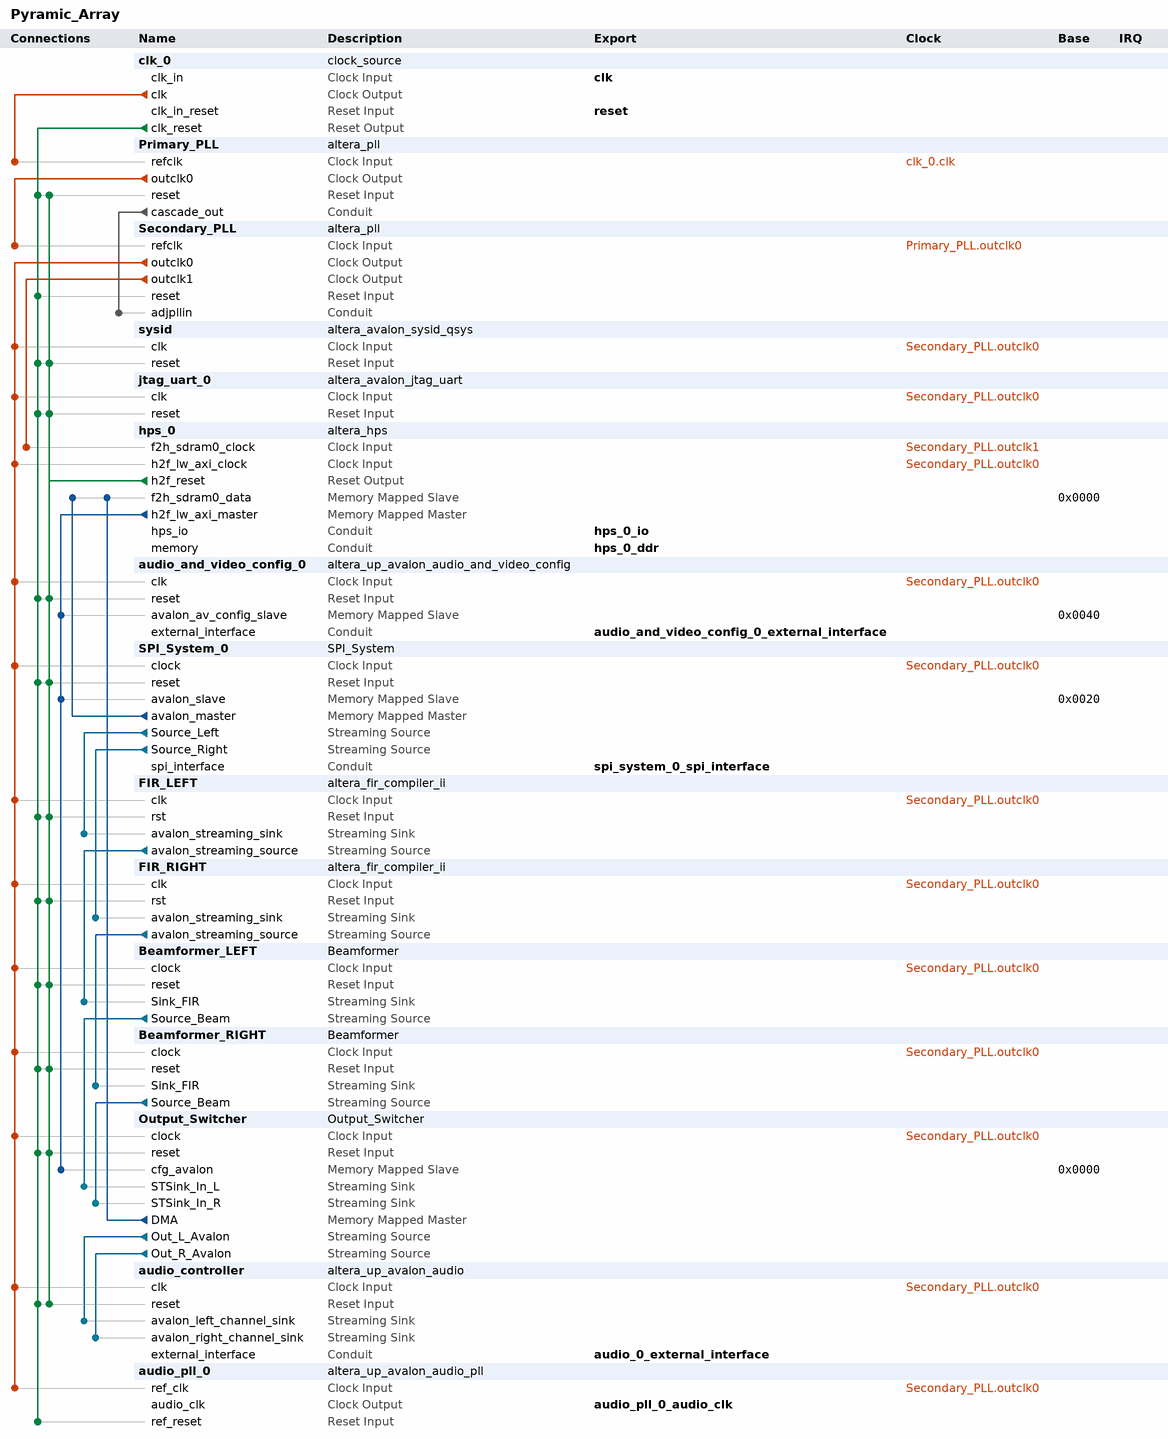
[diagram p0: system contents]
# Platform Designer (Qsys) system Pyramic_Array, Cyclone V 5CSEMA5F31C6
# Parameters at their usual value, and those the tool derives, are not listed.
package require -exact qsys 16.0
create_system Pyramic_Array
set_project_property DEVICE_FAMILY {Cyclone V}
set_project_property DEVICE 5CSEMA5F31C6

add_instance clk_0 clock_source 16.0
set_instance_parameter_value clk_0 clockFrequency 50000000

add_instance Primary_PLL altera_pll 16.0
set_instance_parameter_value Primary_PLL gui_device_speed_grade 2
set_instance_parameter_value Primary_PLL gui_enable_cascade_out true
set_instance_parameter_value Primary_PLL gui_number_of_clocks 1
set_instance_parameter_value Primary_PLL gui_operation_mode normal
set_instance_parameter_value Primary_PLL gui_output_clock_frequency0 48.0
set_instance_parameter_value Primary_PLL gui_pll_mode {Integer-N PLL}
set_instance_parameter_value Primary_PLL gui_reference_clock_frequency 50.0
set_instance_parameter_value Primary_PLL gui_use_locked false

add_instance Secondary_PLL altera_pll 16.0
set_instance_parameter_value Secondary_PLL gui_device_speed_grade 1
set_instance_parameter_value Secondary_PLL gui_enable_cascade_in true
set_instance_parameter_value Secondary_PLL gui_number_of_clocks 2
set_instance_parameter_value Secondary_PLL gui_operation_mode direct
set_instance_parameter_value Secondary_PLL gui_output_clock_frequency0 48.0
set_instance_parameter_value Secondary_PLL gui_output_clock_frequency1 96.0
set_instance_parameter_value Secondary_PLL gui_pll_mode {Integer-N PLL}
set_instance_parameter_value Secondary_PLL gui_reference_clock_frequency 48.0
set_instance_parameter_value Secondary_PLL gui_use_locked false

add_instance sysid altera_avalon_sysid_qsys 16.0
set_instance_parameter_value sysid id 1

add_instance jtag_uart_0 altera_avalon_jtag_uart 16.0
set_instance_parameter_value jtag_uart_0 simInteractiveOptions NO_INTERACTIVE_WINDOWS

add_instance hps_0 altera_hps 16.0
set_instance_parameter_value hps_0 EMAC1_Mode RGMII
set_instance_parameter_value hps_0 EMAC1_PinMuxing {HPS I/O Set 0}
set_instance_parameter_value hps_0 F2SCLK_COLDRST_Enable false
set_instance_parameter_value hps_0 F2SCLK_DBGRST_Enable false
set_instance_parameter_value hps_0 F2SCLK_WARMRST_Enable false
set_instance_parameter_value hps_0 F2SDRAM_Type {Avalon-MM Bidirectional}
set_instance_parameter_value hps_0 F2SDRAM_Width 32
set_instance_parameter_value hps_0 F2SINTERRUPT_Enable false
set_instance_parameter_value hps_0 F2S_Width 0
set_instance_parameter_value hps_0 FPGA_PERIPHERAL_OUTPUT_CLOCK_FREQ_EMAC0_GTX_CLK 125
set_instance_parameter_value hps_0 FPGA_PERIPHERAL_OUTPUT_CLOCK_FREQ_EMAC0_MD_CLK 2.5
set_instance_parameter_value hps_0 FPGA_PERIPHERAL_OUTPUT_CLOCK_FREQ_EMAC1_GTX_CLK 125
set_instance_parameter_value hps_0 FPGA_PERIPHERAL_OUTPUT_CLOCK_FREQ_EMAC1_MD_CLK 2.5
set_instance_parameter_value hps_0 HPS_PROTOCOL DDR3
set_instance_parameter_value hps_0 I2C0_Mode N/A
set_instance_parameter_value hps_0 I2C0_PinMuxing Unused
set_instance_parameter_value hps_0 I2C1_Mode N/A
set_instance_parameter_value hps_0 I2C1_PinMuxing Unused
set_instance_parameter_value hps_0 LWH2F_Enable true
set_instance_parameter_value hps_0 MEM_BANKADDR_WIDTH 3
set_instance_parameter_value hps_0 MEM_CLK_FREQ 400.0
set_instance_parameter_value hps_0 MEM_COL_ADDR_WIDTH 10
set_instance_parameter_value hps_0 MEM_DQ_WIDTH 32
set_instance_parameter_value hps_0 MEM_DRV_STR RZQ/7
set_instance_parameter_value hps_0 MEM_ROW_ADDR_WIDTH 15
set_instance_parameter_value hps_0 MEM_RTT_NOM RZQ/4
set_instance_parameter_value hps_0 MEM_RTT_WR RZQ/4
set_instance_parameter_value hps_0 MEM_TCL 11
set_instance_parameter_value hps_0 MEM_TFAW_NS 30.0
set_instance_parameter_value hps_0 MEM_TRAS_NS 35.0
set_instance_parameter_value hps_0 MEM_TRCD_NS 13.75
set_instance_parameter_value hps_0 MEM_TRFC_NS 260.0
set_instance_parameter_value hps_0 MEM_TRP_NS 13.75
set_instance_parameter_value hps_0 MEM_VENDOR Other
set_instance_parameter_value hps_0 MEM_WTCL 8
set_instance_parameter_value hps_0 QSPI_Mode N/A
set_instance_parameter_value hps_0 QSPI_PinMuxing Unused
set_instance_parameter_value hps_0 REF_CLK_FREQ 25.0
set_instance_parameter_value hps_0 S2FCLK_USER2CLK 1
set_instance_parameter_value hps_0 S2F_Width 0
set_instance_parameter_value hps_0 SDIO_Mode {4-bit Data}
set_instance_parameter_value hps_0 SDIO_PinMuxing {HPS I/O Set 0}
set_instance_parameter_value hps_0 SPIM1_Mode N/A
set_instance_parameter_value hps_0 SPIM1_PinMuxing Unused
set_instance_parameter_value hps_0 STM_Enable false
set_instance_parameter_value hps_0 TIMING_BOARD_AC_SKEW 0.02
set_instance_parameter_value hps_0 TIMING_BOARD_AC_TO_CK_SKEW 0.01
set_instance_parameter_value hps_0 TIMING_BOARD_DQ_TO_DQS_SKEW 0.05
set_instance_parameter_value hps_0 TIMING_BOARD_MAX_CK_DELAY 0.03
set_instance_parameter_value hps_0 TIMING_BOARD_MAX_DQS_DELAY 0.02
set_instance_parameter_value hps_0 TIMING_BOARD_SKEW_BETWEEN_DQS 0.06
set_instance_parameter_value hps_0 TIMING_BOARD_SKEW_CKDQS_DIMM_MAX 0.12
set_instance_parameter_value hps_0 TIMING_BOARD_SKEW_CKDQS_DIMM_MIN 0.06
set_instance_parameter_value hps_0 TIMING_BOARD_SKEW_WITHIN_DQS 0.01
set_instance_parameter_value hps_0 TIMING_TDH 65
set_instance_parameter_value hps_0 TIMING_TDQSCK 255
set_instance_parameter_value hps_0 TIMING_TDQSQ 125
set_instance_parameter_value hps_0 TIMING_TDS 30
set_instance_parameter_value hps_0 TIMING_TIH 140
set_instance_parameter_value hps_0 TIMING_TIS 180
set_instance_parameter_value hps_0 TIMING_TQSH 0.4
set_instance_parameter_value hps_0 UART0_Mode {No Flow Control}
set_instance_parameter_value hps_0 UART0_PinMuxing {HPS I/O Set 0}
set_instance_parameter_value hps_0 USB1_Mode N/A
set_instance_parameter_value hps_0 USB1_PinMuxing Unused
set_instance_parameter_value hps_0 desired_cfg_clk_mhz 100.0
set_instance_parameter_value hps_0 desired_qspi_clk_mhz 400.0

add_instance audio_and_video_config_0 altera_up_avalon_audio_and_video_config 15.1
set_instance_parameter_value audio_and_video_config_0 audio_in {Microphone to ADC}
set_instance_parameter_value audio_and_video_config_0 bit_length 16
set_instance_parameter_value audio_and_video_config_0 board DE1-SoC
set_instance_parameter_value audio_and_video_config_0 line_in_bypass false
set_instance_parameter_value audio_and_video_config_0 sampling_rate {48 kHz}

add_instance SPI_System_0 SPI_System 1.0

add_instance FIR_LEFT altera_fir_compiler_ii 16.0
set_instance_parameter_value FIR_LEFT coeffBitWidth 15
set_instance_parameter_value FIR_LEFT coeffFracBitWidth 15
set_instance_parameter_value FIR_LEFT coeffReload false
set_instance_parameter_value FIR_LEFT coeffType frac
set_instance_parameter_value FIR_LEFT decimFactor 3
set_instance_parameter_value FIR_LEFT filterType frac
set_instance_parameter_value FIR_LEFT inputBitWidth 16
set_instance_parameter_value FIR_LEFT inputChannelNum 48
set_instance_parameter_value FIR_LEFT inputFracBitWidth 0
set_instance_parameter_value FIR_LEFT inputRate 0.048
set_instance_parameter_value FIR_LEFT inputType int
set_instance_parameter_value FIR_LEFT interpFactor 2
set_instance_parameter_value FIR_LEFT outLsbBitRem 7
set_instance_parameter_value FIR_LEFT outMsbBitRem 0
set_instance_parameter_value FIR_LEFT outType int
set_instance_parameter_value FIR_LEFT readWriteMode read_write
set_instance_parameter_value FIR_LEFT speedGrade medium

add_instance FIR_RIGHT altera_fir_compiler_ii 16.0
set_instance_parameter_value FIR_RIGHT coeffBitWidth 15
set_instance_parameter_value FIR_RIGHT coeffFracBitWidth 15
set_instance_parameter_value FIR_RIGHT coeffReload false
set_instance_parameter_value FIR_RIGHT coeffType frac
set_instance_parameter_value FIR_RIGHT decimFactor 3
set_instance_parameter_value FIR_RIGHT filterType frac
set_instance_parameter_value FIR_RIGHT inputBitWidth 16
set_instance_parameter_value FIR_RIGHT inputChannelNum 48
set_instance_parameter_value FIR_RIGHT inputFracBitWidth 0
set_instance_parameter_value FIR_RIGHT inputRate 0.048
set_instance_parameter_value FIR_RIGHT inputType int
set_instance_parameter_value FIR_RIGHT interpFactor 2
set_instance_parameter_value FIR_RIGHT outLsbBitRem 7
set_instance_parameter_value FIR_RIGHT outMsbBitRem 0
set_instance_parameter_value FIR_RIGHT outType int
set_instance_parameter_value FIR_RIGHT readWriteMode read_write
set_instance_parameter_value FIR_RIGHT speedGrade medium

add_instance Beamformer_LEFT Beamformer 1.0
set_instance_parameter_value Beamformer_LEFT DATA_WIDTH 32

add_instance Beamformer_RIGHT Beamformer 1.0
set_instance_parameter_value Beamformer_RIGHT DATA_WIDTH 32

add_instance Output_Switcher Output_Switcher 1.0
set_instance_parameter_value Output_Switcher ONE_CHANNEL_SAMPLE_WIDTH 16
set_instance_parameter_value Output_Switcher TWO_CHANNELS_SAMPLE_WIDTH 32

add_instance audio_controller altera_up_avalon_audio 15.1
set_instance_parameter_value audio_controller audio_in false
set_instance_parameter_value audio_controller avalon_bus_type Streaming
set_instance_parameter_value audio_controller dw 16

add_instance audio_pll_0 altera_up_avalon_audio_pll 15.1
set_instance_parameter_value audio_pll_0 gui_refclk 48.0

# connections
add_connection clk_0.clk Primary_PLL.refclk clock
add_connection Primary_PLL.outclk0 Secondary_PLL.refclk clock
add_connection Secondary_PLL.outclk0 audio_and_video_config_0.clk clock
add_connection Secondary_PLL.outclk0 audio_controller.clk clock
add_connection Secondary_PLL.outclk0 audio_pll_0.ref_clk clock
add_connection Secondary_PLL.outclk0 Beamformer_LEFT.clock clock
add_connection Secondary_PLL.outclk0 Beamformer_RIGHT.clock clock
add_connection Secondary_PLL.outclk0 FIR_LEFT.clk clock
add_connection Secondary_PLL.outclk0 FIR_RIGHT.clk clock
add_connection Secondary_PLL.outclk0 hps_0.h2f_lw_axi_clock clock
add_connection Secondary_PLL.outclk0 jtag_uart_0.clk clock
add_connection Secondary_PLL.outclk0 Output_Switcher.clock clock
add_connection Secondary_PLL.outclk0 SPI_System_0.clock clock
add_connection Secondary_PLL.outclk0 sysid.clk clock
add_connection Secondary_PLL.outclk1 hps_0.f2h_sdram0_clock clock
add_connection clk_0.clk_reset audio_and_video_config_0.reset reset
add_connection clk_0.clk_reset audio_controller.reset reset
add_connection clk_0.clk_reset audio_pll_0.ref_reset reset
add_connection clk_0.clk_reset Beamformer_LEFT.reset reset
add_connection clk_0.clk_reset Beamformer_RIGHT.reset reset
add_connection clk_0.clk_reset FIR_LEFT.rst reset
add_connection clk_0.clk_reset FIR_RIGHT.rst reset
add_connection clk_0.clk_reset jtag_uart_0.reset reset
add_connection clk_0.clk_reset Output_Switcher.reset reset
add_connection clk_0.clk_reset Primary_PLL.reset reset
add_connection clk_0.clk_reset Secondary_PLL.reset reset
add_connection clk_0.clk_reset SPI_System_0.reset reset
add_connection clk_0.clk_reset sysid.reset reset
add_connection hps_0.h2f_reset audio_and_video_config_0.reset reset
add_connection hps_0.h2f_reset audio_controller.reset reset
add_connection hps_0.h2f_reset Beamformer_LEFT.reset reset
add_connection hps_0.h2f_reset Beamformer_RIGHT.reset reset
add_connection hps_0.h2f_reset FIR_LEFT.rst reset
add_connection hps_0.h2f_reset FIR_RIGHT.rst reset
add_connection hps_0.h2f_reset jtag_uart_0.reset reset
add_connection hps_0.h2f_reset Output_Switcher.reset reset
add_connection hps_0.h2f_reset Primary_PLL.reset reset
add_connection hps_0.h2f_reset SPI_System_0.reset reset
add_connection hps_0.h2f_reset sysid.reset reset
add_connection hps_0.h2f_lw_axi_master audio_and_video_config_0.avalon_av_config_slave avalon
set_connection_parameter_value hps_0.h2f_lw_axi_master/audio_and_video_config_0.avalon_av_config_slave baseAddress 0x0040
add_connection hps_0.h2f_lw_axi_master Output_Switcher.cfg_avalon avalon
set_connection_parameter_value hps_0.h2f_lw_axi_master/Output_Switcher.cfg_avalon baseAddress 0x0000
add_connection hps_0.h2f_lw_axi_master SPI_System_0.avalon_slave avalon
set_connection_parameter_value hps_0.h2f_lw_axi_master/SPI_System_0.avalon_slave baseAddress 0x0020
add_connection Output_Switcher.DMA hps_0.f2h_sdram0_data avalon
set_connection_parameter_value Output_Switcher.DMA/hps_0.f2h_sdram0_data baseAddress 0x0000
add_connection SPI_System_0.avalon_master hps_0.f2h_sdram0_data avalon
set_connection_parameter_value SPI_System_0.avalon_master/hps_0.f2h_sdram0_data baseAddress 0x0000
add_connection Beamformer_LEFT.Source_Beam Output_Switcher.STSink_In_L avalon_streaming
add_connection Beamformer_RIGHT.Source_Beam Output_Switcher.STSink_In_R avalon_streaming
add_connection FIR_LEFT.avalon_streaming_source Beamformer_LEFT.Sink_FIR avalon_streaming
add_connection FIR_RIGHT.avalon_streaming_source Beamformer_RIGHT.Sink_FIR avalon_streaming
add_connection Output_Switcher.Out_L_Avalon audio_controller.avalon_left_channel_sink avalon_streaming
add_connection Output_Switcher.Out_R_Avalon audio_controller.avalon_right_channel_sink avalon_streaming
add_connection SPI_System_0.Source_Left FIR_LEFT.avalon_streaming_sink avalon_streaming
add_connection SPI_System_0.Source_Right FIR_RIGHT.avalon_streaming_sink avalon_streaming
add_connection Primary_PLL.cascade_out Secondary_PLL.adjpllin conduit

# exported interfaces
add_interface audio_0_external_interface conduit end
set_interface_property audio_0_external_interface EXPORT_OF audio_controller.external_interface
add_interface audio_and_video_config_0_external_interface conduit end
set_interface_property audio_and_video_config_0_external_interface EXPORT_OF audio_and_video_config_0.external_interface
add_interface audio_pll_0_audio_clk clock source
set_interface_property audio_pll_0_audio_clk EXPORT_OF audio_pll_0.audio_clk
add_interface clk clock sink
set_interface_property clk EXPORT_OF clk_0.clk_in
add_interface hps_0_ddr conduit end
set_interface_property hps_0_ddr EXPORT_OF hps_0.memory
add_interface hps_0_io conduit end
set_interface_property hps_0_io EXPORT_OF hps_0.hps_io
add_interface reset reset sink
set_interface_property reset EXPORT_OF clk_0.clk_in_reset
add_interface spi_system_0_spi_interface conduit end
set_interface_property spi_system_0_spi_interface EXPORT_OF SPI_System_0.spi_interface

set_interconnect_requirement {$system} qsys_mm.clockCrossingAdapter HANDSHAKE
set_interconnect_requirement {$system} qsys_mm.enableEccProtection FALSE
set_interconnect_requirement {$system} qsys_mm.insertDefaultSlave FALSE
set_interconnect_requirement {$system} qsys_mm.maxAdditionalLatency 1

save_system Pyramic_Array.qsys
